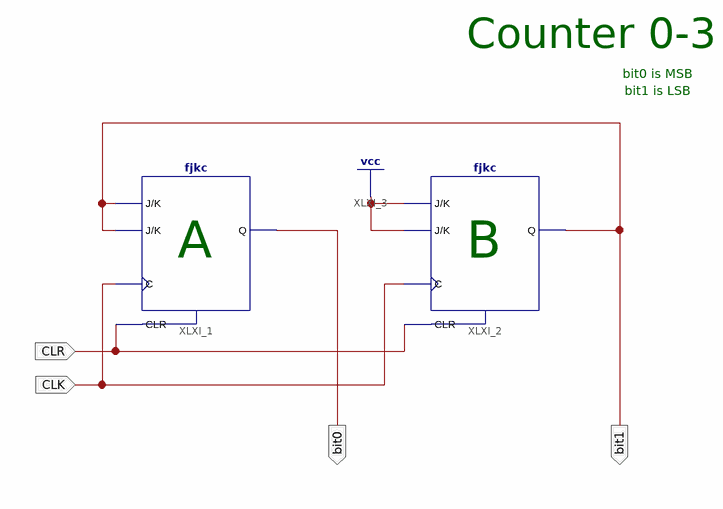
[diagram p0: schematic sheet 1]
// Xilinx ISE schematic counter3.sch (spartan6) as structural Verilog: 2 symbols, 4 ports
module counter3 (
  input  CLR,
  input  CLK,
  output bit0,
  output bit1
);

  fjkc XLXI_1 (.C(CLK), .CLR(CLR), .J(bit1), .K(bit1), .Q(bit0));
  fjkc XLXI_2 (.C(CLK), .CLR(CLR), .J(1'b1), .K(1'b1), .Q(bit1));

  // Notes on the sheet:
  //   Counter 0-3
  //   bit0 is MSB
  //   bit1 is LSB
  //   A
  //   B
endmodule
